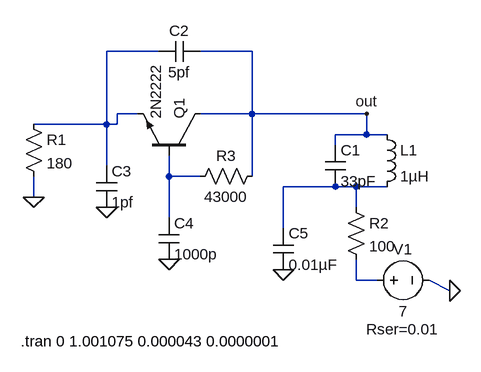
[diagram p0: schematic ultra-audion.asc]
ultra-audion.asc, the LTspice schematic file:
Version 4
SHEET 1 880 680
WIRE -112 0 -192 0
WIRE 32 0 -48 0
WIRE -144 96 -176 96
WIRE 32 96 32 0
WIRE 32 96 -48 96
WIRE 208 96 32 96
WIRE -192 112 -192 0
WIRE -192 112 -304 112
WIRE -176 112 -176 96
WIRE -176 112 -192 112
WIRE 208 128 208 96
WIRE 208 128 160 128
WIRE 240 128 208 128
WIRE 160 144 160 128
WIRE -192 176 -192 112
WIRE -96 192 -96 160
WIRE -48 192 -96 192
WIRE 32 192 32 96
WIRE 160 208 80 208
WIRE 192 208 160 208
WIRE 240 208 192 208
WIRE -304 224 -304 192
WIRE 192 240 192 208
WIRE -96 256 -96 192
WIRE 80 272 80 208
WIRE 192 352 192 320
WIRE 224 352 192 352
WIRE 336 368 304 352
FLAG 336 368 0
FLAG -304 224 0
FLAG -192 240 0
FLAG 208 96 out
FLAG -96 320 0
FLAG 80 336 0
SYMBOL npn -48 160 M270
SYMATTR InstName Q1
SYMATTR Value 2N2222
SYMBOL ind 224 112 R0
SYMATTR InstName L1
SYMATTR Value 1µH
SYMBOL cap 144 144 R0
SYMATTR InstName C1
SYMATTR Value 33pF
SYMBOL cap -48 -16 R90
WINDOW 0 0 32 VBottom 2
WINDOW 3 32 32 VTop 2
SYMATTR InstName C2
SYMATTR Value 5pf
SYMBOL res -320 96 R0
SYMATTR InstName R1
SYMATTR Value 180
SYMBOL res 176 224 R0
SYMATTR InstName R2
SYMATTR Value 100
SYMBOL res 48 176 R90
WINDOW 0 0 56 VBottom 2
WINDOW 3 32 56 VTop 2
SYMATTR InstName R3
SYMATTR Value 43000
SYMBOL voltage 208 352 M90
WINDOW 0 -32 56 VBottom 2
WINDOW 3 32 56 VTop 2
WINDOW 123 0 0 Left 2
WINDOW 39 60 56 VTop 2
SYMATTR InstName V1
SYMATTR Value 7
SYMATTR SpiceLine Rser=0.01
SYMBOL cap -208 176 R0
SYMATTR InstName C3
SYMATTR Value 1pf
SYMBOL cap -112 256 R0
SYMATTR InstName C4
SYMATTR Value 1000p
SYMBOL cap 64 272 R0
SYMATTR InstName C5
SYMATTR Value 0.01µF
TEXT -324 446 Left 2 !.tran 0 1.001075 0.000043 0.0000001

The netlist it stands for:
* ultra-audion.asc
Q1 out N002 N001 0 2N2222
L1 out N003 1µH
C1 out N003 33pF
C2 out N001 5pf
R1 N001 0 180
R2 N003 N004 100
R3 out N002 43000
V1 N004 0 7 Rser=0.01
C3 N001 0 1pf
C4 N002 0 1000p
C5 N003 0 0.01µF
.model NPN NPN
.model PNP PNP
.lib standard.bjt
.tran 0 1.001075 0.000043 0.0000001
.backanno
.end